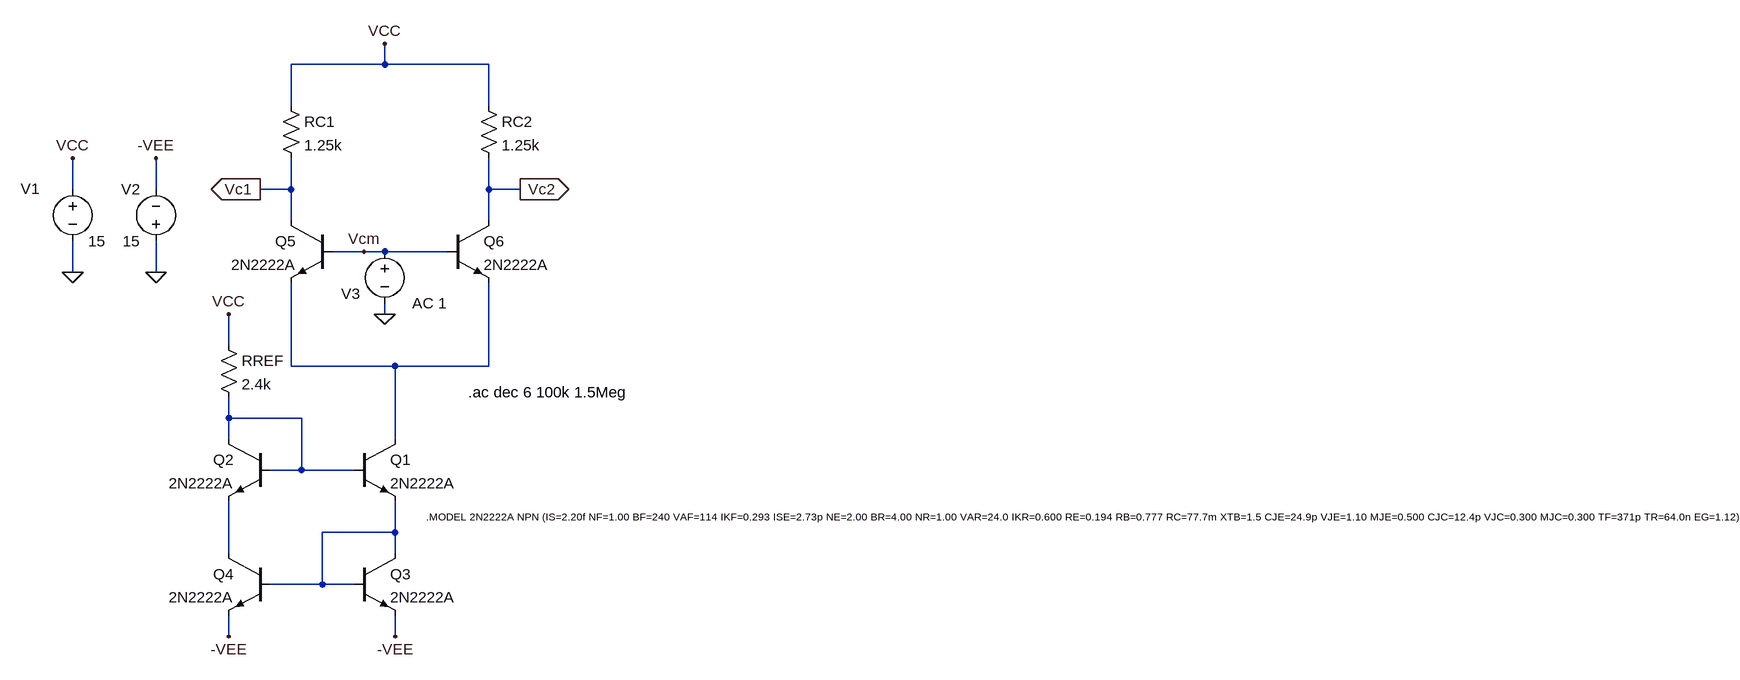
[diagram p0: schematic DiffAmp_Currsrc_CM.asc]
DiffAmp_Currsrc_CM.asc, the LTspice schematic file:
Version 4
SHEET 1 2688 760
WIRE 464 -224 464 -256
WIRE 464 -224 320 -224
WIRE 624 -224 464 -224
WIRE 320 -160 320 -224
WIRE 624 -160 624 -224
WIRE -16 -32 -16 -80
WIRE 112 -32 112 -80
WIRE 320 -32 320 -80
WIRE 320 -32 272 -32
WIRE 624 -32 624 -80
WIRE 672 -32 624 -32
WIRE 320 16 320 -32
WIRE 624 16 624 -32
WIRE 432 64 384 64
WIRE 464 64 432 64
WIRE 560 64 464 64
WIRE -16 96 -16 48
WIRE 112 96 112 48
WIRE 464 160 464 144
WIRE 224 208 224 160
WIRE 320 240 320 112
WIRE 480 240 320 240
WIRE 624 240 624 112
WIRE 624 240 480 240
WIRE 224 320 224 288
WIRE 336 320 224 320
WIRE 224 352 224 320
WIRE 480 352 480 240
WIRE 336 400 336 320
WIRE 336 400 288 400
WIRE 416 400 336 400
WIRE 480 496 480 448
WIRE 480 496 368 496
WIRE 224 528 224 448
WIRE 480 528 480 496
WIRE 368 576 368 496
WIRE 368 576 288 576
WIRE 416 576 368 576
WIRE 224 656 224 624
WIRE 480 656 480 624
FLAG -16 96 0
FLAG 112 96 0
FLAG -16 -80 VCC
FLAG 112 -80 -VEE
FLAG 224 160 VCC
FLAG 224 656 -VEE
FLAG 480 656 -VEE
FLAG 672 -32 Vc2
IOPIN 672 -32 Out
FLAG 272 -32 Vc1
IOPIN 272 -32 Out
FLAG 464 -256 VCC
FLAG 464 160 0
FLAG 432 64 Vcm
SYMBOL npn 416 352 R0
SYMATTR InstName Q1
SYMATTR Value 2N2222A
SYMBOL npn 288 352 M0
SYMATTR InstName Q2
SYMATTR Value 2N2222A
SYMBOL voltage -16 -48 R0
WINDOW 0 -80 15 Left 2
SYMATTR InstName V1
SYMATTR Value 15
SYMBOL voltage 112 64 R180
WINDOW 0 24 96 Left 2
WINDOW 3 24 16 Left 2
SYMATTR InstName V2
SYMATTR Value 15
SYMBOL res 208 192 R0
SYMATTR InstName RREF
SYMATTR Value 2.4k
SYMBOL npn 416 528 R0
SYMATTR InstName Q3
SYMATTR Value 2N2222A
SYMBOL npn 288 528 M0
SYMATTR InstName Q4
SYMATTR Value 2N2222A
SYMBOL res 304 -176 R0
SYMATTR InstName RC1
SYMATTR Value 1.25k
SYMBOL res 608 -176 R0
SYMATTR InstName RC2
SYMATTR Value 1.25k
SYMBOL npn 384 16 M0
SYMATTR InstName Q5
SYMATTR Value 2N2222A
SYMBOL npn 560 16 R0
SYMATTR InstName Q6
SYMATTR Value 2N2222A
SYMBOL voltage 464 48 R0
WINDOW 0 -67 81 Left 2
WINDOW 3 -84 140 Invisible 2
WINDOW 123 42 95 Left 2
SYMATTR InstName V3
SYMATTR Value 0
SYMATTR Value2 AC 1
TEXT 528 472 Left 1 !.MODEL 2N2222A NPN (IS=2.20f NF=1.00 BF=240 VAF=114 IKF=0.293 ISE=2.73p NE=2.00 BR=4.00 NR=1.00 VAR=24.0 IKR=0.600 RE=0.194 RB=0.777 RC=77.7m XTB=1.5 CJE=24.9p VJE=1.10 MJE=0.500 CJC=12.4p VJC=0.300 MJC=0.300 TF=371p TR=64.0n EG=1.12)
TEXT 592 280 Left 2 !.ac dec 6 100k 1.5Meg

The netlist it stands for:
* DiffAmp_Currsrc_CM.asc
Q1 N001 N002 N003 0 2N2222A
Q2 N002 N002 N004 0 2N2222A
V1 VCC 0 15
V2 0 -VEE 15
RREF VCC N002 2.4k
Q3 N003 N003 -VEE 0 2N2222A
Q4 N004 N003 -VEE 0 2N2222A
RC1 VCC Vc1 1.25k
RC2 VCC Vc2 1.25k
Q5 Vc1 Vcm N001 0 2N2222A
Q6 Vc2 Vcm N001 0 2N2222A
V3 Vcm 0 0 AC 1
.model NPN NPN
.model PNP PNP
.lib standard.bjt
.MODEL 2N2222A NPN (IS=2.20f NF=1.00 BF=240 VAF=114 IKF=0.293 ISE=2.73p NE=2.00 BR=4.00 NR=1.00 VAR=24.0 IKR=0.600 RE=0.194 RB=0.777 RC=77.7m XTB=1.5 CJE=24.9p VJE=1.10 MJE=0.500 CJC=12.4p VJC=0.300 MJC=0.300 TF=371p TR=64.0n EG=1.12)
.ac dec 6 100k 1.5Meg
.backanno
.end